# Altium schematic sheet 电源母板.SchDoc
size A4
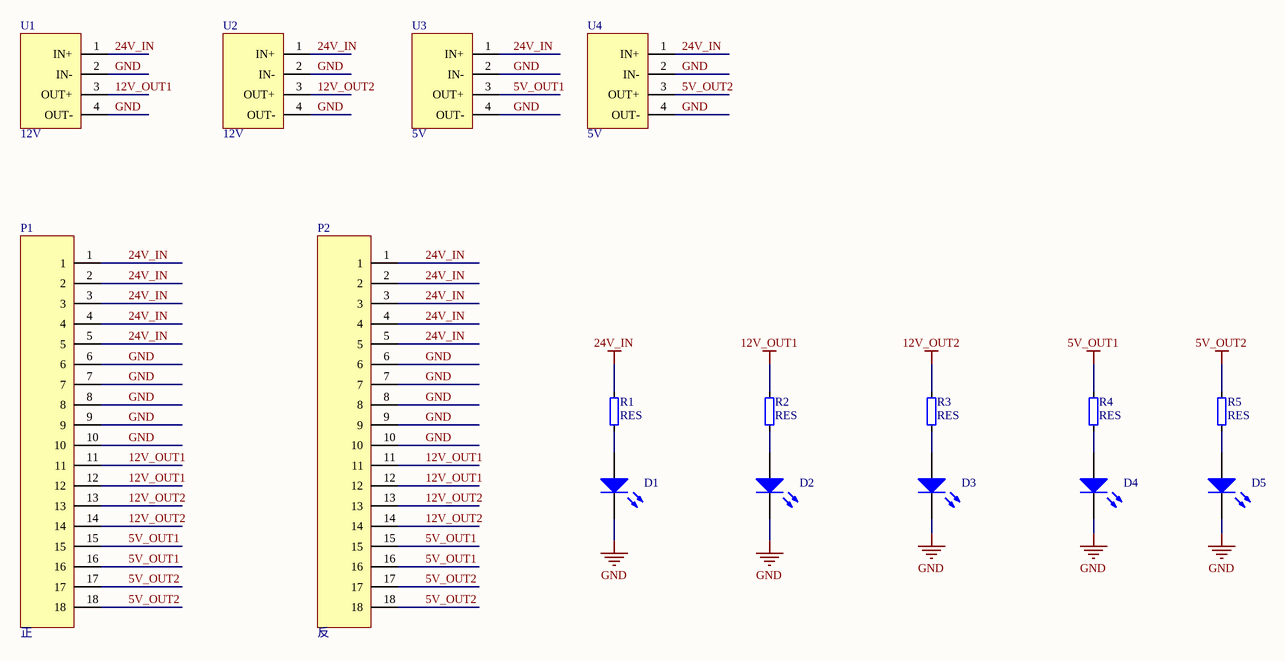
[diagram p0: 电源母板.SchDoc]

## Parts
D1  D_LED 3MM  [0603_LED]  (value not drawn)
D2  D_LED 3MM  [0603_LED]  (value not drawn)
D3  D_LED 3MM  [0603_LED]  (value not drawn)
D4  D_LED 3MM  [0603_LED]  (value not drawn)
D5  D_LED 3MM  [0603_LED]  (value not drawn)
P1  正  [1X16]
P2  反  [1X16]
R1  RES  [0603]
R2  RES  [0603]
R3  RES  [0603]
R4  RES  [0603]
R5  RES  [0603]
U1  12V  [LM2596稳压模块]
U2  12V  [LM2596稳压模块]
U3  5V  [LM2596稳压模块]
U4  5V  [LM2596稳压模块]

## Nets
5V_OUT1: P1.15 P1.16 P2.15 P2.16 R4.2 U3.3(OUT+)
5V_OUT2: P1.17 P1.18 P2.17 P2.18 R5.2 U4.3(OUT+)
12V_OUT1: P1.11 P1.12 P2.11 P2.12 R2.2 U1.3(OUT+)
12V_OUT2: P1.13 P1.14 P2.13 P2.14 R3.2 U2.3(OUT+)
24V_IN: P1.1 P1.2 P1.3 P1.4 P1.5 P2.1 P2.2 P2.3 P2.4 P2.5 R1.2 U1.1(IN+) U2.1(IN+) U3.1(IN+) U4.1(IN+)
GND: D1.2(K) D2.2(K) D3.2(K) D4.2(K) D5.2(K) P1.6 P1.7 P1.8 P1.9 P1.10 P2.6 P2.7 P2.8 P2.9 P2.10 U1.2(IN-) U1.4(OUT-) U2.2(IN-) U2.4(OUT-) U3.2(IN-) U3.4(OUT-) U4.2(IN-) U4.4(OUT-)
NetD1_1: D1.1(A) R1.1
NetD2_1: D2.1(A) R2.1
NetD3_1: D3.1(A) R3.1
NetD4_1: D4.1(A) R4.1
NetD5_1: D5.1(A) R5.1

## Library data of the parts
P1 P2 = 1X18
U1-U4 = 稳压模块